# EAGLE design 2leds (EAGLE 7.2.0)
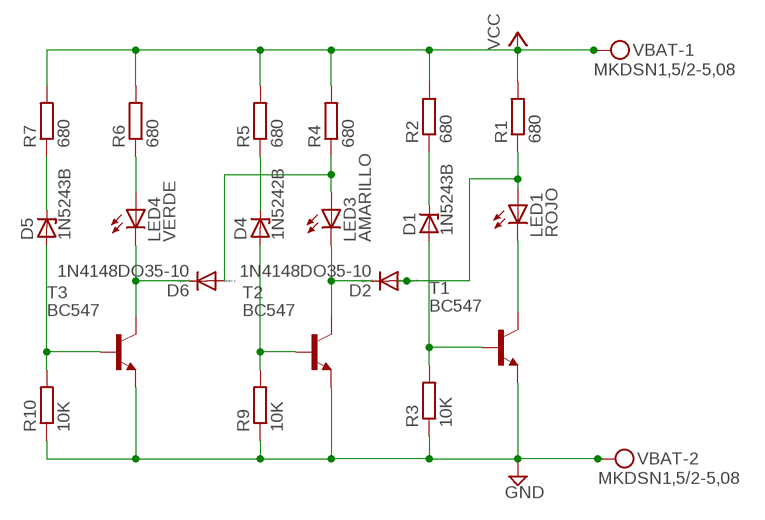
[diagram p0: schematic, sheet 1]

## Parts
D1  1N5243B  ZENER-DIODEDO35Z10  [DO35Z10]
D2  1N4148DO35-10  [DO35-10]
D4  1N5242B  ZENER-DIODEDO35Z10  [DO35Z10]
D5  1N5243B  ZENER-DIODEDO35Z10  [DO35Z10]
D6  1N4148DO35-10  [DO35-10]
LED1  ROJO  LED3MM  [LED3MM]
LED3  AMARILLO  LED3MM  [LED3MM]
LED4  VERDE  LED3MM  [LED3MM]
R1  680  R-EU_0207/10  [0207/10]
R2  680  R-EU_0207/10  [0207/10]
R3  10K  R-EU_0207/10  [0207/10]
R4  680  R-EU_0207/10  [0207/10]
R5  680  R-EU_0207/10  [0207/10]
R6  680  R-EU_0207/10  [0207/10]
R7  680  R-EU_0207/10  [0207/10]
R9  10K  R-EU_0207/10  [0207/10]
R10  10K  R-EU_0207/10  [0207/10]
T1  BC547  [TO92]
T2  BC547  [TO92]
T3  BC547  [TO92]
VBAT  MKDSN1,5/2-5,08  [MKDSN1,5/2-5,08]

## Nets
GND: R3.1 R9.1 R10.1 T1.1(E) T2.1(E) T3.1(E) VBAT.2
N$3: D1.A R3.2 T1.2(B)
N$5: LED1.K(C) T1.3(C)
N$6: D5.A R10.2 T3.2(B)
N$7: D4.A R9.2 T2.2(B)
N$8: D2.A LED1.A R1.1
N$9: D2.C LED3.K(C) T2.3(C)
N$10: D6.A LED3.A R4.1
N$11: D4.C R5.1
N$12: D1.C R2.1
N$13: D6.C LED4.K(C) T3.3(C)
N$14: LED4.A R6.1
N$15: D5.C R7.1
VCC: R1.2 R2.2 R4.2 R5.2 R6.2 R7.2 VBAT.1

## Library data of the parts
D1 D4 D5 = diode:ZENER-DIODE: Z-Diode
D2 D6 = diode:1N4148: DIODE high speed (Philips)
LED1 LED3 LED4 = led:LED: LED OSRAM: - CHIPLED LG R971, LG N971, LY N971, LG Q971, LY Q971, LO R971, LY R971 LH N974, LH R974 LS Q976, LO Q976, LY Q976 LO Q996 - Hyper CHIPLED LW Q18S LB Q993, LB Q99A, LB R99A - SideLED LS A670, LO A670, LY A670, LG A670, LP A670 LB A673, LV A673, LT A673, LW A673 LH A674 LY A675 LS A676, LA A676, LO A676, LY A676, LW A676 LS A679, LY A679, LG A679 - Hyper Micro SIDELED® LS Y876, LA Y876, LO Y876, LY Y876 LT Y87S - SmartLED LW L88C, LW L88S LB L89C, LB L89S, LG L890 LS L89K, LO L89K, LY L89K LS L896, LA L896, LO L896, LY L896 - TOPLED LS T670, LO T670, LY T670, LG T670, LP T670 LSG T670, LSP T670, LSY T670, LOP T670, LYG T670 LG T671, LOG T671, LSG T671 LB T673, LV T673, LT T673, LW T673 LH T674 LS T676, LA T676, LO T676, LY T676, LB T676, LH T676, LSB T676, LW T676 LB T67C, LV T67C, LT T67C, LS T67K, LO T67K, LY T67K, LW E67C LS E67B, LA E67B, LO E67B, LY E67B, LB E67C, LV E67C, LT E67C LW T67C LS T679, LY T679, LG T679 LS T770, LO T770, LY T770, LG T770, LP T770 LB T773, LV T773, LT T773, LW T773 LH T774 LS E675, LA E675, LY E675, LS T675 LS T776, LA T776, LO T776, LY T776, LB T776 LHGB T686 LT T68C, LB T68C - Hyper Mini TOPLED® LB M676 - Mini TOPLED Santana® LG M470 LS M47K, LO M47K, LY M47K Source: http://www.osram.convergy.de LUXEON: - LUMILED® LXK2-PW12-R00, LXK2-PW12-S00, LXK2-PW14-U00, LXK2-PW14-V00 LXK2-PM12-R00, LXK2-PM12-S00, LXK2-PM14-U00 LXK2-PE12-Q00, LXK2-PE12-R00, LXK2-PE12-S00, LXK2-PE14-T00, LXK2-PE14-U00 LXK2-PB12-K00, LXK2-PB12-L00, LXK2-PB12-M00, LXK2-PB14-N00, LXK2-PB14-P00, LXK2-PB14-Q00 LXK2-PR12-L00, LXK2-PR12-M00, LXK2-PR14-Q00, LXK2-PR14-R00 LXK2-PD12-Q00, LXK2-PD12-R00, LXK2-PD12-S00 LXK2-PH12-R00, LXK2-PH12-S00 LXK2-PL12-P00, LXK2-PL12-Q00, LXK2-PL12-R00 Source: www.luxeon.com KINGBRIGHT: KA-3528ASYC Source: www.kingbright.com
R1-R7 R9 R10 = resistor:R-EU_: RESISTOR, European symbol
T1-T3 = transistor:BC547: NPN TRANSISTOR
VBAT = con-phoenix-508:MKDSN1,5/2-5,08: MKDSN 1,5/ 2-5,08 Printklemme Nennstrom: 13,5 A Nennspannung: 250 V Rastermaß: 5,08 mm Polzahl: 2 Anschlussart: Schraubanschluss Montage: Löten Anschlussrichtung Leiter/Platine: 0 ° Artikelnummer: 1729128 Source: http://eshop.phoenixcontact.com .. 1729128.pdf

## Board
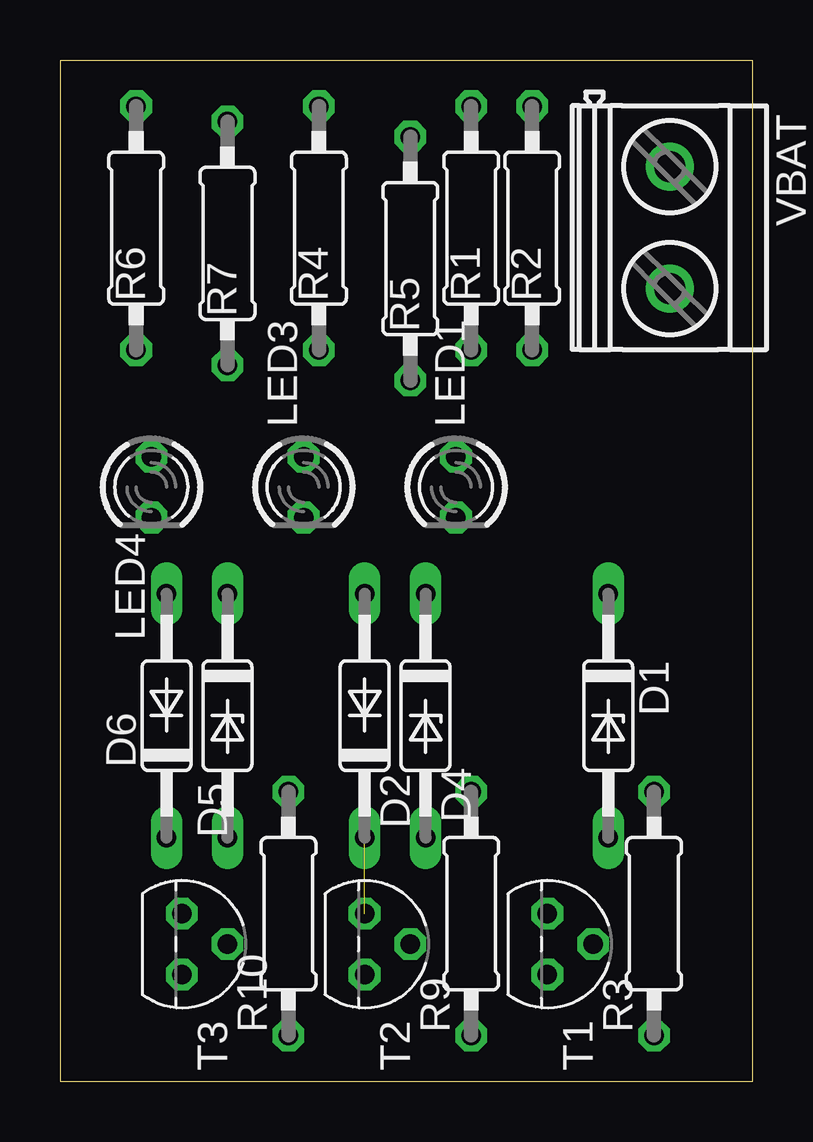
[diagram p1: board, top side]
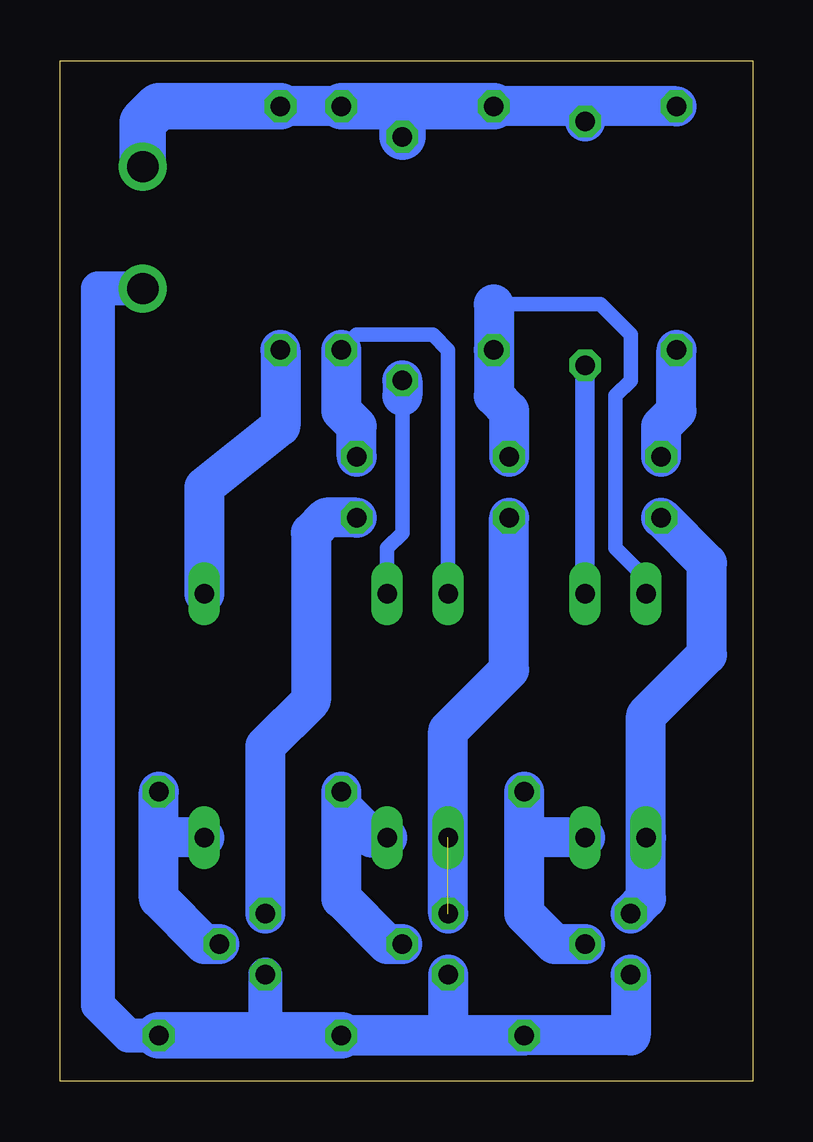
[diagram p2: board, bottom side, seen from below]

Size 28.88 x 42.54 mm. Coordinates in mm from the lower left corner, seen from the top.
Outline: 0,0 28.88,0 28.88,42.54 0,42.54 0,0
Copper layers (1*16): Top 0.035mm / dielectric 1.5mm / Bottom 0.035mm
Design rules "default": minimum track width 10mil, minimum drill 24mil, track to track 8mil, track to pad 8mil, pad to pad 8mil, via to via 8mil, smd to smd 8mil, copper to edge 40mil, drill to drill 8mil, minimum pad ring 10mil, minimum via ring 8mil, stop-mask expansion 4mil, vias tented up to drill 0mil, thermal gap 10mil

### Footprints (pad centres in the part's own frame; a part is rotated, then mirrored left to right if it is on the bottom)
DO35Z10 = drill 0.813 long: A 5.08,0; C -5.08,0
DO35-10 = drill 0.813 long: A 5.08,0; C -5.08,0
LED3MM = drill 0.813 octagon: A -1.27,0; K 1.27,0
0207/10 = drill 0.813 octagon: 1 -5.08,0; 2 5.08,0
TO92 = drill 0.813 octagon: 1 1.27,0; 2 0,1.905; 3 -1.27,0
MKDSN1,5/2-5,08 = drill 1.3 pad 2: 1 -2.561,0.025; 2 2.519,0.025

### Placement (x,y rotation side)
D1  22.86,15.24 270 top
D2  12.7,15.24 90 top
D4  15.24,15.24 270 top
D5  6.98,15.24 270 top
D6  4.45,15.24 90 top
LED1  16.51,24.77 270 top
LED3  10.16,24.77 270 top
LED4  3.81,24.77 270 top
R1  17.15,35.56 90 top
R2  19.69,35.56 90 top
R3  24.77,6.98 90 top
R4  10.8,35.56 90 top
R5  14.61,34.29 90 top
R6  3.18,35.56 90 top
R7  6.98,34.93 90 top
R9  17.15,6.98 90 top
R10  9.52,6.98 90 top
T1  20.32,5.71 270 top
T2  12.7,5.71 270 top
T3  5.08,5.71 270 top
VBAT  25.4,35.56 270 top

### Tracks (layer width: path | path; a pad name or v marks a point on that pad's centre or on a via)
GND
  Bottom 1.422: VBAT.2 27.3,33.04 27.3,3.18 26.04,1.91 R3.1 | T1.1 20.32,1.91
  Bottom 1.676: T3.1 5.08,1.91 R10.1 | R10.1 12.7,1.91 | 12.7,1.91 R9.1 R10.1 | T2.1 12.7,1.91
  Bottom 1.93: R9.1 20.32,1.91 R3.1
N$3
  Bottom 1.676: T1.2 22.86,5.71 24.77,7.62 24.77,10.16 | 24.77,10.16 R3.2 | D1.A 24.77,10.16
N$5
  Bottom 1.676: T1.3 20.32,13.97 18.41,15.87 18.41,22.86 17.78,23.49 LED1.K
N$6
  Bottom 1.676: T3.2 8.26,5.71 9.52,6.98 9.52,10.16 | 9.52,10.16 R10.2 | D5.A 9.52,10.16
N$7
  Bottom 1.676: T2.2 15.24,5.71 17.15,7.62 17.15,11.43 | 17.15,11.43 R9.2 | D4.A 15.88,10.16 17.15,11.43
N$8
  Bottom 0.61: D2.A 12.7,30.48 13.34,31.12 16.51,31.12 R1.1
  Bottom 1.676: LED1.A 16.51,27.3 17.15,27.94 R1.1
N$9  (1 unrouted)
  Bottom 1.676: T2.3 12.7,14.6 10.16,17.15 LED3.K
N$10
  Bottom 0.61: D6.A 4.45,20.95 5.72,22.23 5.72,28.58 5.08,29.21 5.08,31.12 6.35,32.39 10.8,32.39
  Bottom 1.676: 10.8,32.39 R4.1 10.8,28.58 10.16,27.94 LED3.A
N$11
  Bottom 0.61: 14.61,28.58 14.61,22.86 15.24,22.23 D4.C
  Bottom 1.676: R5.1 14.61,28.58
N$12
  Bottom 1.676: R2.1 19.69,27.3 22.86,24.77 D1.C
N$13
  Bottom 1.676: T3.3 4.45,7.62 D6.C 4.45,15.24 1.91,17.78 1.91,21.59 LED4.K
N$14
  Bottom 1.676: LED4.A 3.81,27.3 3.18,27.94 R6.1
N$15
  Bottom 0.813: D5.C R7.1
VCC
  Bottom 1.676: R6.2 6.98,40.64 | 6.98,40.64 R4.2 | R1.2 R2.2 | R7.2 6.98,40.64
  Bottom 1.93: VBAT.1 25.43,39.98 24.77,40.64 R2.2 | R4.2 14.61,40.64 | 14.61,40.64 R1.2 | R5.2 14.61,40.64